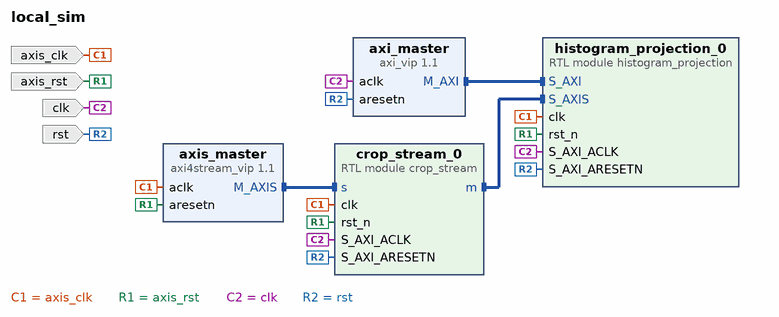
[diagram p0: block diagram of the top level]
# Vivado block design local_sim, xc7z020clg400-1, Vivado 2022.2
create_bd_design local_sim

create_bd_port -dir I -type clk clk
set_property -dict {CONFIG.FREQ_HZ 100000000} [get_bd_ports clk]
create_bd_port -dir I -type rst rst
create_bd_port -dir I -type clk axis_clk
set_property -dict {CONFIG.FREQ_HZ 142000000} [get_bd_ports axis_clk]
create_bd_port -dir I -type rst axis_rst

create_bd_cell -type ip -vlnv xilinx.com:ip:axi4stream_vip:1.1 axis_master
set_property -dict [list \
  CONFIG.HAS_TKEEP 0 \
  CONFIG.HAS_TLAST 1 \
  CONFIG.HAS_TREADY 1 \
  CONFIG.HAS_TSTRB 0 \
  CONFIG.HAS_TUSER_BITS_PER_BYTE 0 \
  CONFIG.INTERFACE_MODE MASTER \
  CONFIG.TDATA_NUM_BYTES 1 \
  CONFIG.TDEST_WIDTH 0 \
  CONFIG.TID_WIDTH 0 \
  CONFIG.TUSER_WIDTH 1 \
] [get_bd_cells axis_master]
create_bd_cell -type ip -vlnv xilinx.com:ip:axi_vip:1.1 axi_master
set_property -dict [list \
  CONFIG.ADDR_WIDTH 32 \
  CONFIG.DATA_WIDTH 32 \
  CONFIG.HAS_BRESP 1 \
  CONFIG.HAS_PROT 1 \
  CONFIG.HAS_RRESP 1 \
  CONFIG.HAS_WSTRB 1 \
  CONFIG.INTERFACE_MODE MASTER \
  CONFIG.PROTOCOL AXI4LITE \
  CONFIG.READ_WRITE_MODE READ_WRITE \
] [get_bd_cells axi_master]
create_bd_cell -type module -reference crop_stream crop_stream_0
set_property -dict [list \
  CONFIG.DEFAULT_LIMIT_LOWER_X 0 \
  CONFIG.DEFAULT_LIMIT_LOWER_Y 0 \
  CONFIG.DEFAULT_LIMIT_UPPER_X 180 \
  CONFIG.DEFAULT_LIMIT_UPPER_Y 180 \
] [get_bd_cells crop_stream_0]
create_bd_cell -type module -reference histogram_projection histogram_projection_0
set_property -dict {CONFIG.IMAGE_HEIGHT 120 CONFIG.IMAGE_WIDTH 180} [get_bd_cells histogram_projection_0]

# ---- connections ----

connect_bd_intf_net [get_bd_intf_pins axi_master/M_AXI] [get_bd_intf_pins histogram_projection_0/S_AXI]
connect_bd_intf_net [get_bd_intf_pins axis_master/M_AXIS] [get_bd_intf_pins crop_stream_0/s]
connect_bd_intf_net [get_bd_intf_pins crop_stream_0/m] [get_bd_intf_pins histogram_projection_0/S_AXIS]
connect_bd_net [get_bd_ports axis_clk] [get_bd_pins axis_master/aclk] [get_bd_pins crop_stream_0/clk] [get_bd_pins histogram_projection_0/clk]
connect_bd_net [get_bd_ports axis_rst] [get_bd_pins axis_master/aresetn] [get_bd_pins crop_stream_0/rst_n] [get_bd_pins histogram_projection_0/rst_n]
connect_bd_net [get_bd_ports clk] [get_bd_pins axi_master/aclk] [get_bd_pins crop_stream_0/S_AXI_ACLK] [get_bd_pins histogram_projection_0/S_AXI_ACLK]
connect_bd_net [get_bd_ports rst] \
  [get_bd_pins axi_master/aresetn] [get_bd_pins crop_stream_0/S_AXI_ARESETN] \
  [get_bd_pins histogram_projection_0/S_AXI_ARESETN]

validate_bd_design
save_bd_design
